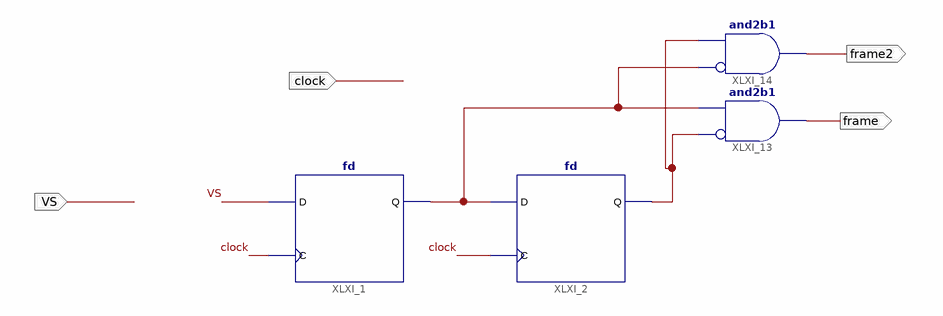
[diagram p0: schematic sheet 1]
// Xilinx ISE schematic Edge_Detector.sch (spartan3e) as structural Verilog: 4 symbols, 4 ports
module Edge_Detector (
  input  clock,
  input  VS,
  output frame,
  output frame2
);

  wire XLXN_47, XLXN_50;

  fd XLXI_1 (.C(clock), .D(VS), .Q(XLXN_50));
  fd XLXI_2 (.C(clock), .D(XLXN_50), .Q(XLXN_47));
  and XLXI_13 (frame, ~XLXN_47, XLXN_50);  // and2b1
  and XLXI_14 (frame2, ~XLXN_50, XLXN_47);  // and2b1
endmodule
